# EAGLE design expansion_mrf24j40ma (EAGLE 5.11)
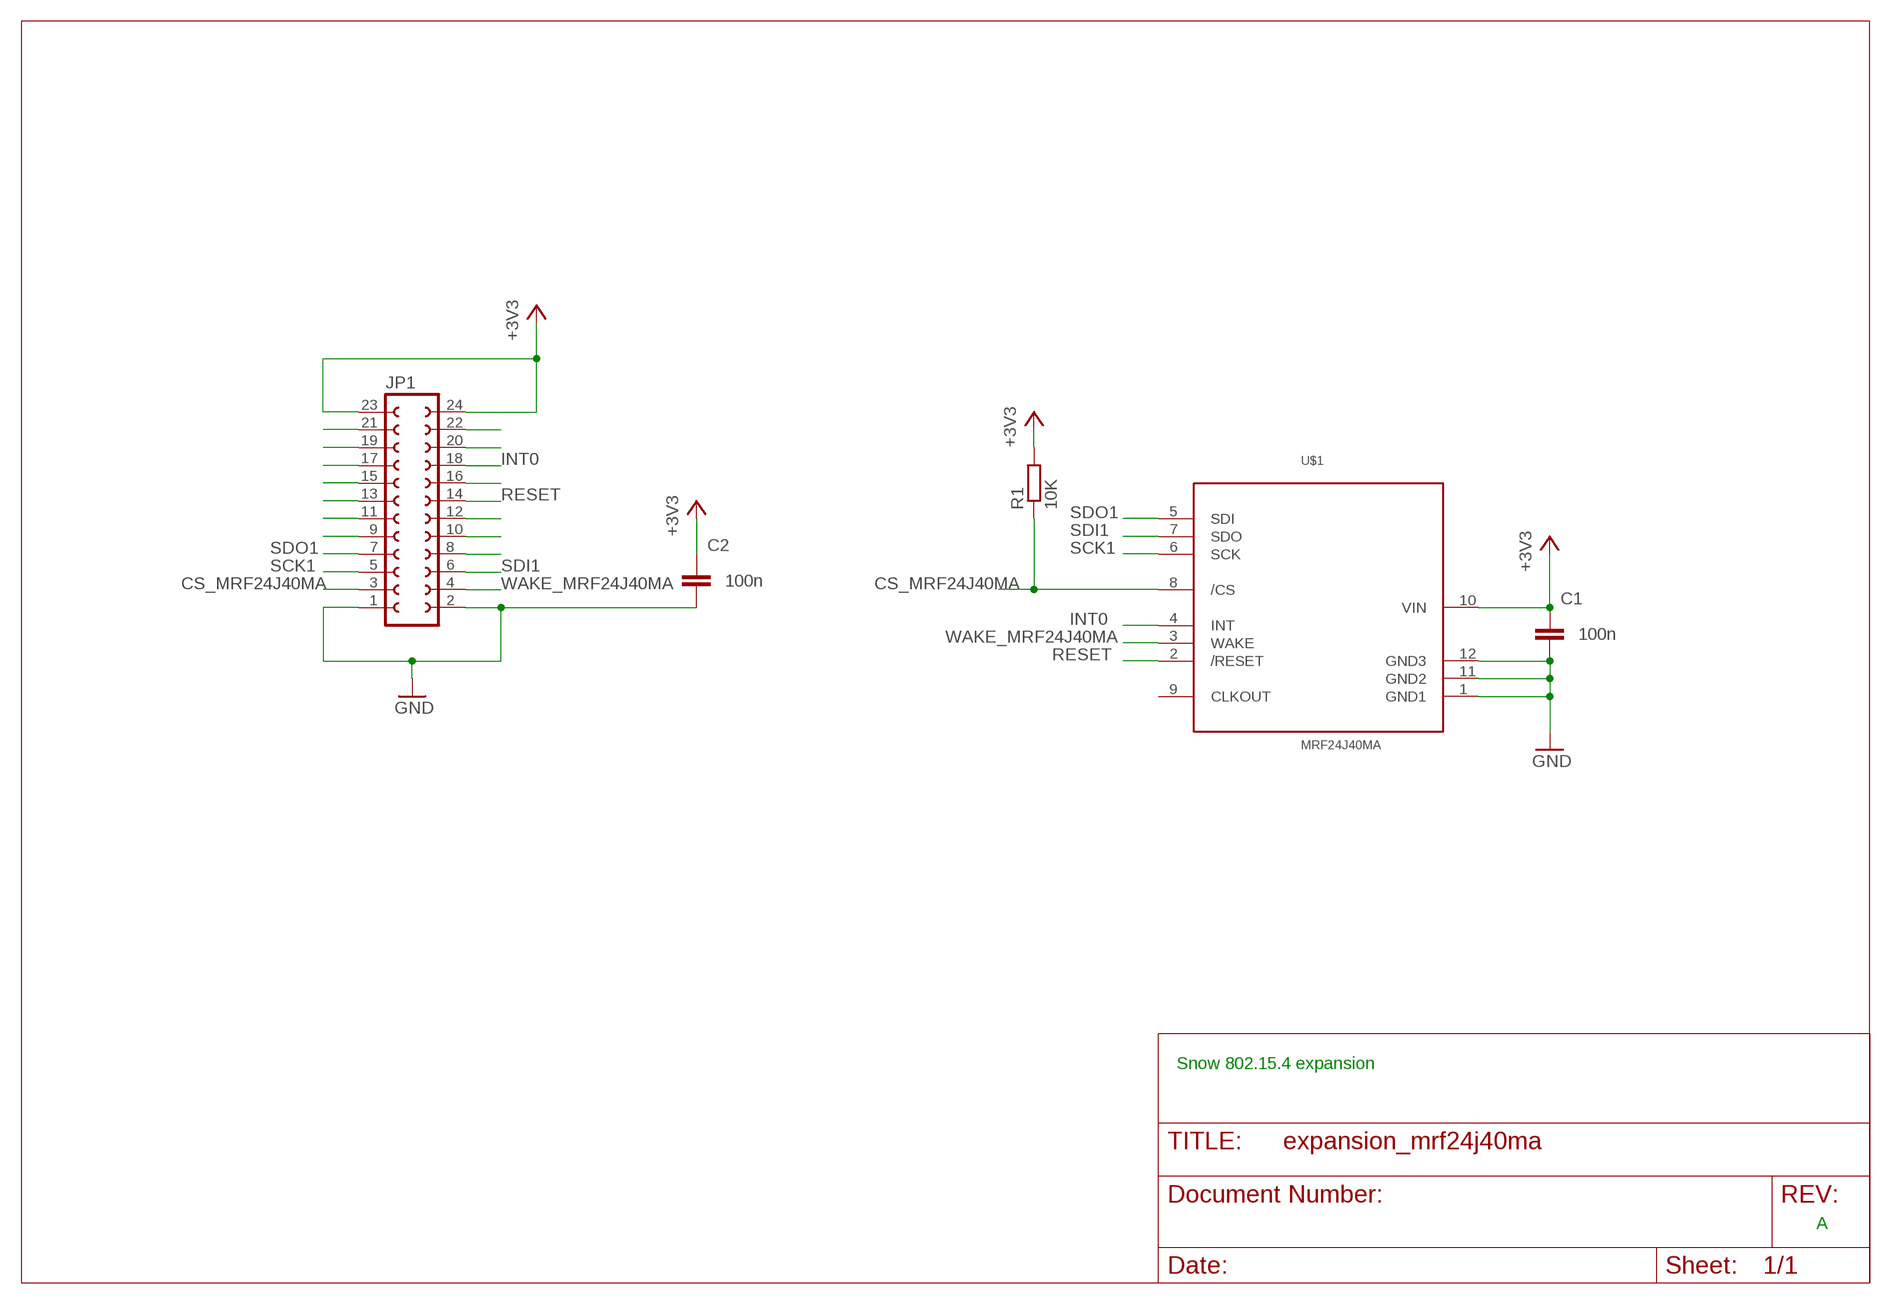
[diagram p0: schematic, sheet 1]

## Parts
C1  100n  C-EUC0805  [C0805]
C2  100n  C-EUC0805  [C0805]
JP1  FE12-2  [FE12-2]
R1  10K  R-EU_R0805  [R0805]
U$1  MRF24J40MA  [MRF24J40MA]

## Nets
+3V3: C1.1 C2.1 JP1.23 JP1.24 R1.2 U$1.10(VIN)
CS_MRF24J40MA: JP1.3 R1.1 U$1.8(/CS)
GND: C1.2 C2.2 JP1.1 JP1.2 U$1.1(GND1) U$1.11(GND2) U$1.12(GND3)
INT0: JP1.18 U$1.4(INT)
N$9: JP1.22
N$10: JP1.20
N$12: JP1.16
N$14: JP1.12
N$15: JP1.10
N$16: JP1.8
N$21: JP1.21
N$22: JP1.19
N$23: JP1.17
N$24: JP1.15
N$25: JP1.13
N$26: JP1.11
N$27: JP1.9
RESET: JP1.14 U$1.2(/RESET)
SCK1: JP1.5 U$1.6(SCK)
SDI1: JP1.6 U$1.7(SDO)
SDO1: JP1.7 U$1.5(SDI)
WAKE_MRF24J40MA: JP1.4 U$1.3(WAKE)
Unconnected: U$1.9(CLKOUT)

## Notes on the sheet
- Snow 802.15.4 expansion
- A

## Library data of the parts
C1 C2 = rcl:C-EU: CAPACITOR, European symbol
JP1 = con-lsta:FE12-2: FEMALE HEADER; OC_FARNELL: unknown; OC_NEWARK: unknown
R1 = rcl:R-EU_: RESISTOR, European symbol
U$1 = eurosource_mrf24j40ma:MRF24J40MA

## Board
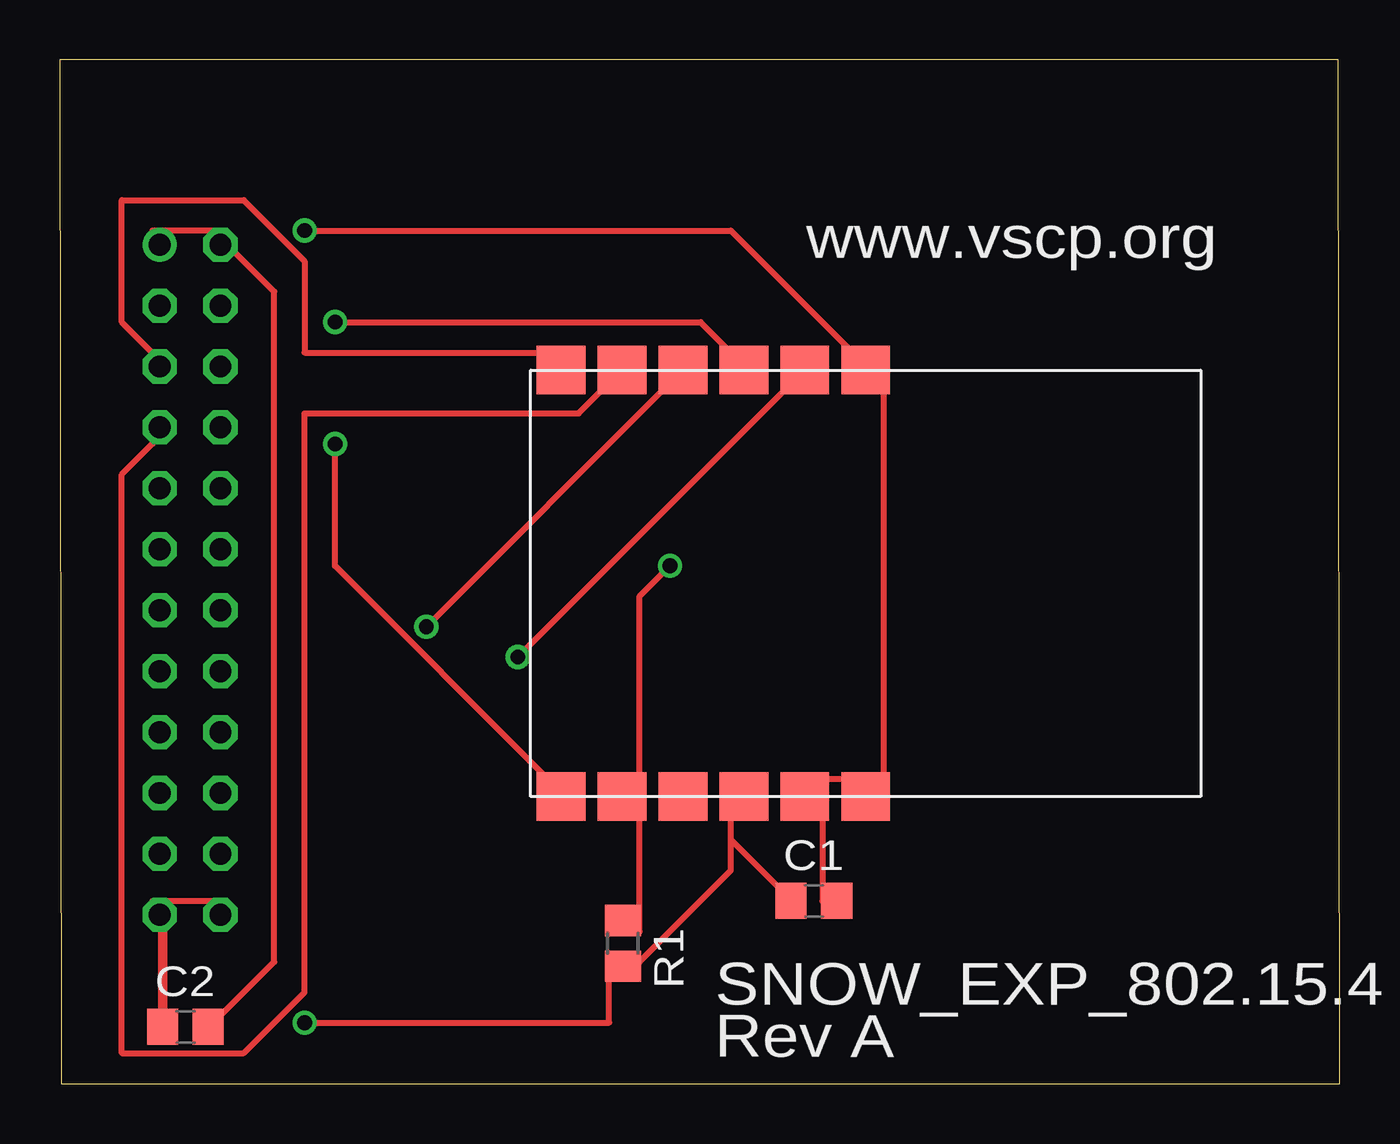
[diagram p1: board, top side]
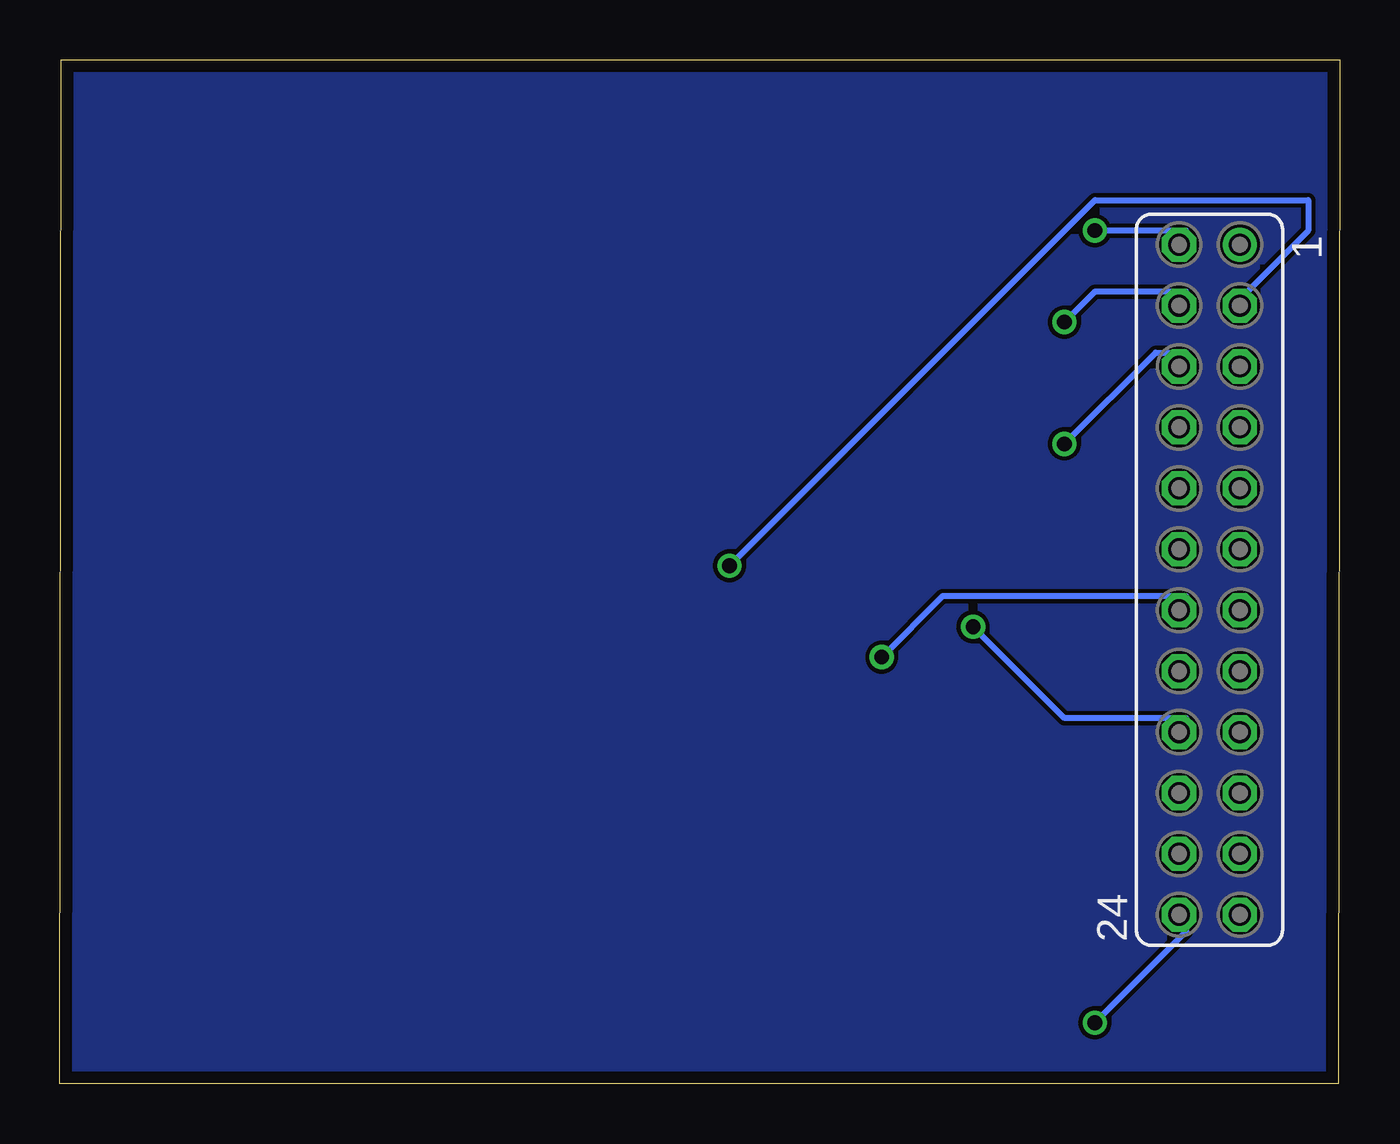
[diagram p2: board, bottom side, seen from below]

Size 53.36 x 42.68 mm. Coordinates in mm from the lower left corner, seen from the top.
Outline: 0.04,0 53.36,0 53.32,42.68 0,42.68 0.04,0
Copper layers (1*16): Top 0.0356mm / dielectric 1.5011mm / Bottom 0.0356mm
Design rules "SilverCircuits": minimum track width 7mil, minimum drill 14mil, track to track 7mil, track to pad 7mil, pad to pad 7mil, via to via 7mil, smd to smd 0mil, copper to edge 20mil, drill to drill 8mil, minimum pad ring 10mil, minimum via ring 8mil, stop-mask expansion 4mil, vias tented up to drill 0mil, thermal gap 10mil

### Footprints (pad centres in the part's own frame; a part is rotated, then mirrored left to right if it is on the bottom)
C0805 = smd 1.3 x 1.5: 1 -0.95,0; 2 0.95,0
FE12-2 = drill 0.914 round: 1 -13.97,1.27 | drill 0.914 octagon: 2 -13.97,-1.27; 3 -11.43,1.27; 4 -11.43,-1.27; 5 -8.89,1.27; 6 -8.89,-1.27; 7 -6.35,1.27; 8 -6.35,-1.27; 9 -3.81,1.27; 10 -3.81,-1.27; 11 -1.27,1.27; 12 -1.27,-1.27; 13 1.27,1.27; 14 1.27,-1.27; 15 3.81,1.27; 16 3.81,-1.27; 17 6.35,1.27; 18 6.35,-1.27; 19 8.89,1.27; 20 8.89,-1.27; 21 11.43,1.27; 22 11.43,-1.27; 23 13.97,1.27; 24 13.97,-1.27
R0805 = smd 1.3 x 1.5: 1 -0.95,0; 2 0.95,0
MRF24J40MA = smd 2.032 x 2.032: 1 -8.89,6.35; 2 -8.89,3.81; 3 -8.89,1.27; 4 -8.89,-1.27; 5 -8.89,-3.81; 6 -8.89,-6.35; 7 8.89,-6.35; 8 8.89,-3.81; 9 8.89,-1.27; 10 8.89,1.27; 11 8.89,3.81; 12 8.89,6.35

### Placement (x,y rotation side)
C1  31.44,7.62 0 top
C2  5.23,2.36 0 top
JP1  5.42,21.01 270 bottom
R1  23.47,5.85 270 top
U$1  27.25,20.86 270 top

### Tracks (layer width: path | path; a pad name or v marks a point on that pad's centre or on a via)
+3V3  (via drill 0.61)
  Top 0.254: JP1.24 6.39,7.62 3.85,7.62 JP1.23 | 27.98,10.16 27.98,11.43 U$1.10 | 27.98,10.16 27.98,8.89 24.17,5.08 R1.2 22.9,5.08 22.9,2.54 v10.2,2.54 | 27.98,10.16 30.52,7.62 C1.1
  Top 0.406: JP1.23 4.28,7.04 C2.1
  Bottom 0.254: v10.2,2.54 6.39,6.35 JP1.24
CS_MRF24J40MA  (via drill 0.61)
  Top 0.254: R1.1 24.17,6.35 24.17,11.43 U$1.8 24.17,12.7 24.17,20.32 v25.44,21.59
  Bottom 0.254: v25.44,21.59 10.2,36.83 1.31,36.83 1.31,35.56 3.85,33.02 JP1.3
GND  (via drill 0.61)
  Top 0.254: C1.2 31.79,7.62 31.79,11.43 U$1.11 31.79,12.7 33.06,12.7 U$1.12 34.33,12.7 34.33,29.21 U$1.1 33.06,30.48 27.98,35.56 v10.2,35.56 | 6.39,35.56 8.93,33.02 8.93,5.08 6.39,2.54 C2.2 | 6.39,35.56 3.85,35.56 JP1.1 | 6.39,35.56 JP1.2
  Bottom 0.254: v10.2,35.56 6.39,35.56 JP1.2
INT0  (via drill 0.61)
  Top 0.254: v15.28,19.05 25.44,29.21 U$1.4
  Bottom 0.254: v15.28,19.05 11.47,15.24 6.39,15.24 JP1.18
N$1
  pour Bottom: 0.33,41.29 0.3,41.29 0.3,0.08 53.3,0.08 53.3,0.17 53.04,0.17 53.04,42.07 0.55,42.07 0.55,40.95
RESET  (via drill 0.61)
  Top 0.254: v19.09,17.78 30.52,29.21 U$1.2
  Bottom 0.254: v19.09,17.78 16.55,20.32 6.39,20.32 JP1.14
SCK1
  Top 0.254: U$1.6 20.36,30.48 10.2,30.48 10.2,34.29 7.66,36.83 2.58,36.83 2.58,31.75 3.85,30.48 JP1.5
SDI1  (via drill 0.61)
  Top 0.254: v11.47,26.67 11.47,21.59 20.36,12.7 U$1.7
  Bottom 0.254: v11.47,26.67 7.66,30.48 6.39,30.48 JP1.6
SDO1
  Top 0.254: U$1.5 22.9,29.21 21.63,27.94 10.2,27.94 10.2,3.81 7.66,1.27 2.58,1.27 2.58,25.4 3.85,26.67 JP1.7
WAKE_MRF24J40MA  (via drill 0.61)
  Top 0.254: v11.47,31.75 26.71,31.75 27.98,30.48 U$1.3
  Bottom 0.254: v11.47,31.75 10.2,33.02 6.39,33.02 JP1.4

### Text on the board
tNames: www.vscp.org | SNOW_EXP_802.15.4 | Rev A